# Altium schematic sheet Hierarchy.SchDoc
size A4; SheetNumber: 1; SheetTotal: 4
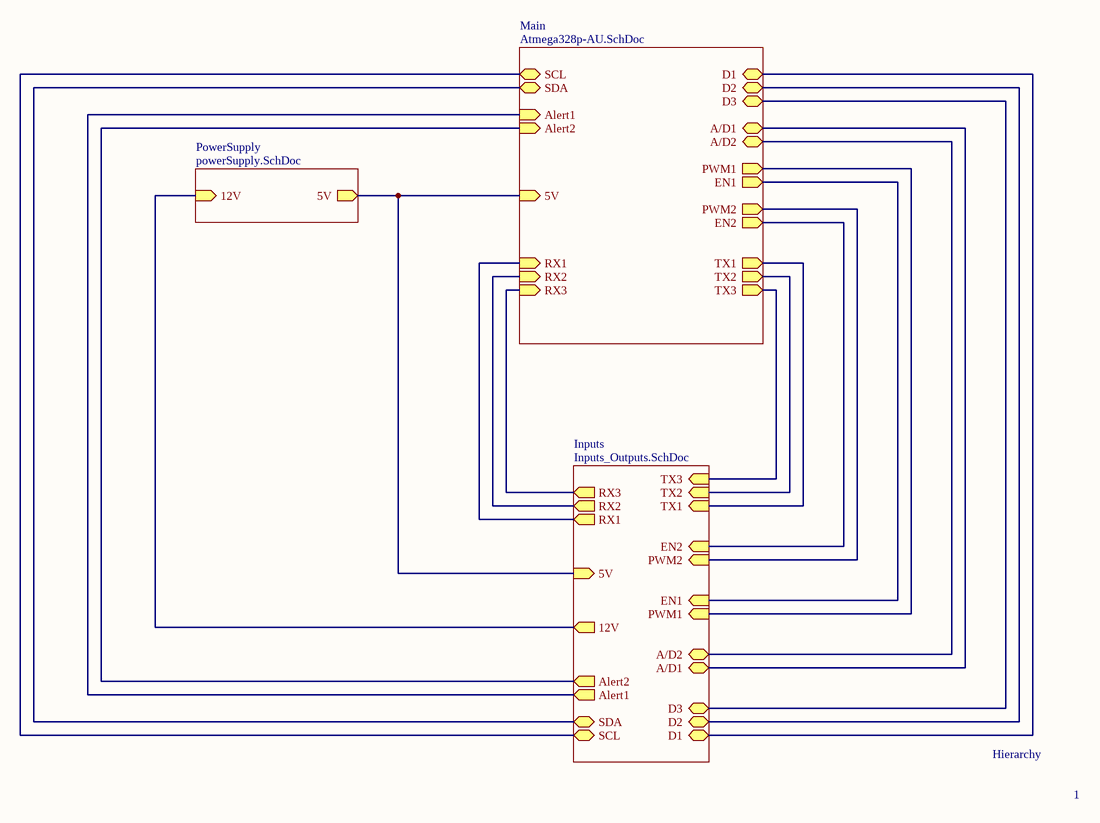
[diagram p0: Hierarchy.SchDoc]

## Sub-sheets
Inputs = Inputs_Outputs.SchDoc: Alert1 (out), Alert2 (out), 12V (out), SCL (bidir), SDA (bidir), TX3 (in), TX2 (in), TX1 (in), EN2 (in), PWM2 (in), EN1 (in), PWM1 (in), A/D2 (bidir), A/D1 (bidir), D3 (bidir), D2 (bidir), D1 (bidir), 5V (in), RX1 (out), RX2 (out), RX3 (out)
Main = Atmega328p-AU.SchDoc: PWM1 (out), EN1 (out), PWM2 (out), EN2 (out), 5V (in), Alert1 (in), Alert2 (in), SCL (bidir), SDA (bidir), RX1 (in), RX2 (in), RX3 (in), TX1 (out), TX2 (out), TX3 (out), D2 (bidir), D3 (bidir), D1 (bidir), A/D1 (bidir), A/D2 (bidir)
PowerSupply = powerSupply.SchDoc: 5V (out), 12V (in)

## Nets
(unnamed): sheet Main/PWM1, sheet Inputs/PWM1
(unnamed): sheet Main/EN1, sheet Inputs/EN1
(unnamed): sheet Main/PWM2, sheet Inputs/PWM2
(unnamed): sheet Main/EN2, sheet Inputs/EN2
(unnamed): sheet Main/5V, sheet PowerSupply/5V, sheet Inputs/5V
(unnamed): sheet Main/Alert1, sheet Inputs/Alert1
(unnamed): sheet Main/Alert2, sheet Inputs/Alert2
(unnamed): sheet Main/SCL, sheet Inputs/SCL
(unnamed): sheet Main/SDA, sheet Inputs/SDA
(unnamed): sheet Main/RX1, sheet Inputs/RX1
(unnamed): sheet Main/RX2, sheet Inputs/RX2
(unnamed): sheet Main/RX3, sheet Inputs/RX3
(unnamed): sheet Main/TX1, sheet Inputs/TX1
(unnamed): sheet Main/TX2, sheet Inputs/TX2
(unnamed): sheet Main/TX3, sheet Inputs/TX3
(unnamed): sheet Main/D2, sheet Inputs/D2
(unnamed): sheet Main/D3, sheet Inputs/D3
(unnamed): sheet Main/D1, sheet Inputs/D1
(unnamed): sheet Main/A/D1, sheet Inputs/A/D1
(unnamed): sheet Main/A/D2, sheet Inputs/A/D2
(unnamed): sheet PowerSupply/12V, sheet Inputs/12V

## Notes on the sheet
- Hierarchy
- 1